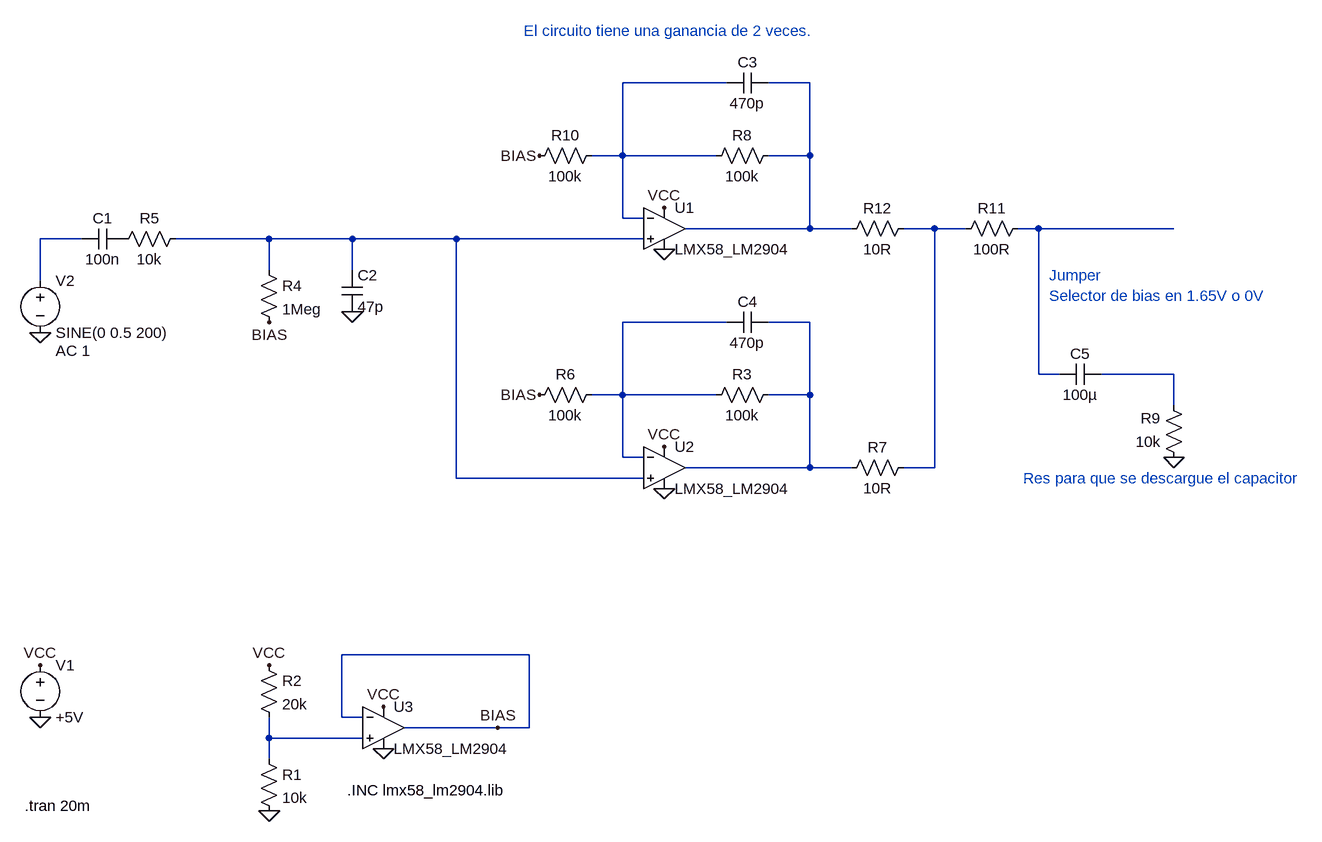
[diagram p0: schematic generador.asc]
generador.asc, the LTspice schematic file:
Version 4
SHEET 1 2564 696
WIRE 992 -688 832 -688
WIRE 1120 -688 1056 -688
WIRE 832 -576 832 -688
WIRE 832 -576 784 -576
WIRE 976 -576 832 -576
WIRE 1120 -576 1120 -688
WIRE 1120 -576 1056 -576
WIRE 832 -480 832 -576
WIRE 864 -480 832 -480
WIRE 1120 -464 1120 -576
WIRE 1120 -464 928 -464
WIRE 1184 -464 1120 -464
WIRE 1312 -464 1264 -464
WIRE 1360 -464 1312 -464
WIRE 1472 -464 1440 -464
WIRE 1680 -464 1472 -464
WIRE 0 -448 -64 -448
WIRE 288 -448 144 -448
WIRE 416 -448 288 -448
WIRE 576 -448 416 -448
WIRE 864 -448 576 -448
WIRE 288 -400 288 -448
WIRE 416 -400 416 -448
WIRE -64 -384 -64 -448
WIRE 992 -320 832 -320
WIRE 1120 -320 1056 -320
WIRE 1472 -240 1472 -464
WIRE 1504 -240 1472 -240
WIRE 1680 -240 1568 -240
WIRE 832 -208 832 -320
WIRE 832 -208 784 -208
WIRE 976 -208 832 -208
WIRE 1120 -208 1120 -320
WIRE 1120 -208 1056 -208
WIRE 1680 -192 1680 -240
WIRE 832 -112 832 -208
WIRE 864 -112 832 -112
WIRE 1120 -96 1120 -208
WIRE 1120 -96 928 -96
WIRE 1184 -96 1120 -96
WIRE 1312 -96 1312 -464
WIRE 1312 -96 1264 -96
WIRE 576 -80 576 -448
WIRE 864 -80 576 -80
WIRE 688 192 400 192
WIRE 400 288 400 192
WIRE 432 288 400 288
WIRE 640 304 496 304
WIRE 688 304 688 192
WIRE 688 304 640 304
WIRE 288 320 288 288
WIRE 432 320 288 320
WIRE 288 352 288 320
FLAG -64 -304 0
FLAG 1680 -112 0
FLAG -64 288 0
FLAG -64 208 VCC
FLAG 896 -496 VCC
FLAG 896 -432 0
FLAG 288 432 0
FLAG 288 208 VCC
FLAG 464 272 VCC
FLAG 464 336 0
FLAG 640 304 BIAS
FLAG 288 -320 BIAS
FLAG 704 -576 BIAS
FLAG 416 -336 0
FLAG 896 -128 VCC
FLAG 896 -64 0
FLAG 704 -208 BIAS
SYMBOL res 48 -432 R270
WINDOW 0 32 56 VTop 2
WINDOW 3 0 56 VBottom 2
SYMATTR InstName R5
SYMATTR Value 10k
SYMBOL voltage -64 -400 R0
WINDOW 123 24 124 Left 2
WINDOW 39 24 152 Left 2
SYMATTR Value2 AC 1
SYMATTR InstName V2
SYMATTR Value SINE(0 0.5 200)
SYMBOL res 1696 -96 R180
WINDOW 0 36 76 Left 2
WINDOW 3 36 40 Left 2
SYMATTR InstName R9
SYMATTR Value 10k
SYMBOL voltage -64 192 R0
WINDOW 123 0 0 Left 0
WINDOW 39 0 0 Left 0
SYMATTR InstName V1
SYMATTR Value +5V
SYMBOL cap 64 -464 R90
WINDOW 0 0 32 VBottom 2
WINDOW 3 32 32 VTop 2
SYMATTR InstName C1
SYMATTR Value 100n
SYMBOL OpAmps\\opamp2 896 -528 R0
SYMATTR InstName U1
SYMATTR Value LMX58_LM2904
SYMBOL res 272 336 R0
SYMATTR InstName R1
SYMATTR Value 10k
SYMBOL res 272 192 R0
SYMATTR InstName R2
SYMATTR Value 20k
SYMBOL OpAmps\\opamp2 464 240 R0
SYMATTR InstName U3
SYMATTR Value LMX58_LM2904
SYMBOL res 272 -416 R0
SYMATTR InstName R4
SYMATTR Value 1Meg
SYMBOL res 1072 -592 R90
WINDOW 0 0 56 VBottom 2
WINDOW 3 32 56 VTop 2
SYMATTR InstName R8
SYMATTR Value 100k
SYMBOL res 800 -592 R90
WINDOW 0 0 56 VBottom 2
WINDOW 3 32 56 VTop 2
SYMATTR InstName R10
SYMATTR Value 100k
SYMBOL cap 1056 -704 R90
WINDOW 0 0 32 VBottom 2
WINDOW 3 32 32 VTop 2
SYMATTR InstName C3
SYMATTR Value 470p
SYMBOL cap 400 -400 R0
SYMATTR InstName C2
SYMATTR Value 47p
SYMBOL res 1280 -480 R90
WINDOW 0 0 56 VBottom 2
WINDOW 3 32 56 VTop 2
SYMATTR InstName R12
SYMATTR Value 10R
SYMBOL OpAmps\\opamp2 896 -160 R0
SYMATTR InstName U2
SYMATTR Value LMX58_LM2904
SYMBOL res 1072 -224 R90
WINDOW 0 0 56 VBottom 2
WINDOW 3 32 56 VTop 2
SYMATTR InstName R3
SYMATTR Value 100k
SYMBOL res 800 -224 R90
WINDOW 0 0 56 VBottom 2
WINDOW 3 32 56 VTop 2
SYMATTR InstName R6
SYMATTR Value 100k
SYMBOL cap 1056 -336 R90
WINDOW 0 0 32 VBottom 2
WINDOW 3 32 32 VTop 2
SYMATTR InstName C4
SYMATTR Value 470p
SYMBOL res 1280 -112 R90
WINDOW 0 0 56 VBottom 2
WINDOW 3 32 56 VTop 2
SYMATTR InstName R7
SYMATTR Value 10R
SYMBOL cap 1568 -256 R90
WINDOW 0 0 32 VBottom 2
WINDOW 3 32 32 VTop 2
SYMATTR InstName C5
SYMATTR Value 100µ
SYMBOL res 1456 -480 R90
WINDOW 0 0 56 VBottom 2
WINDOW 3 32 56 VTop 2
SYMATTR InstName R11
SYMATTR Value 100R
TEXT 408 400 Left 2 !.INC lmx58_lm2904.lib
TEXT -88 424 Left 2 !.tran 20m
TEXT 1448 -80 Left 2 ;Res para que se descargue el capacitor
TEXT 1488 -392 Left 2 ;Jumper\nSelector de bias en 1.65V o 0V
TEXT 680 -768 Left 2 ;El circuito tiene una ganancia de 2 veces.

The netlist it stands for:
* generador.asc
R5 P001 N006 10k
V2 N005 0 SINE(0 0.5 200) AC 1
R9 0 N009 10k
V1 VCC 0 +5V
C1 P001 N005 100n
XU1 N006 N001 VCC 0 N002 LMX58_LM2904  ; pins In+ In- V+ V- OUT
R1 N010 0 10k
R2 VCC N010 20k
XU3 N010 BIAS VCC 0 BIAS LMX58_LM2904  ; pins In+ In- V+ V- OUT
R4 N006 BIAS 1Meg
R8 N002 N001 100k
R10 N001 BIAS 100k
C3 N002 N001 470p
C2 N006 0 47p
R12 N003 N002 10R
XU2 N006 N007 VCC 0 N008 LMX58_LM2904  ; pins In+ In- V+ V- OUT
R3 N008 N007 100k
R6 N007 BIAS 100k
C4 N008 N007 470p
R7 N003 N008 10R
C5 N009 N004 100µ
R11 N004 N003 100R
.INC lmx58_lm2904.lib
.tran 20m
* Res para que se descargue el capacitor
* Jumper
* Selector de bias en 1.65V o 0V
* El circuito tiene una ganancia de 2 veces.
.backanno
.end